# EAGLE design NEW デバッカー10 (EAGLE 9.6.2)

## Sheet 1 of 2
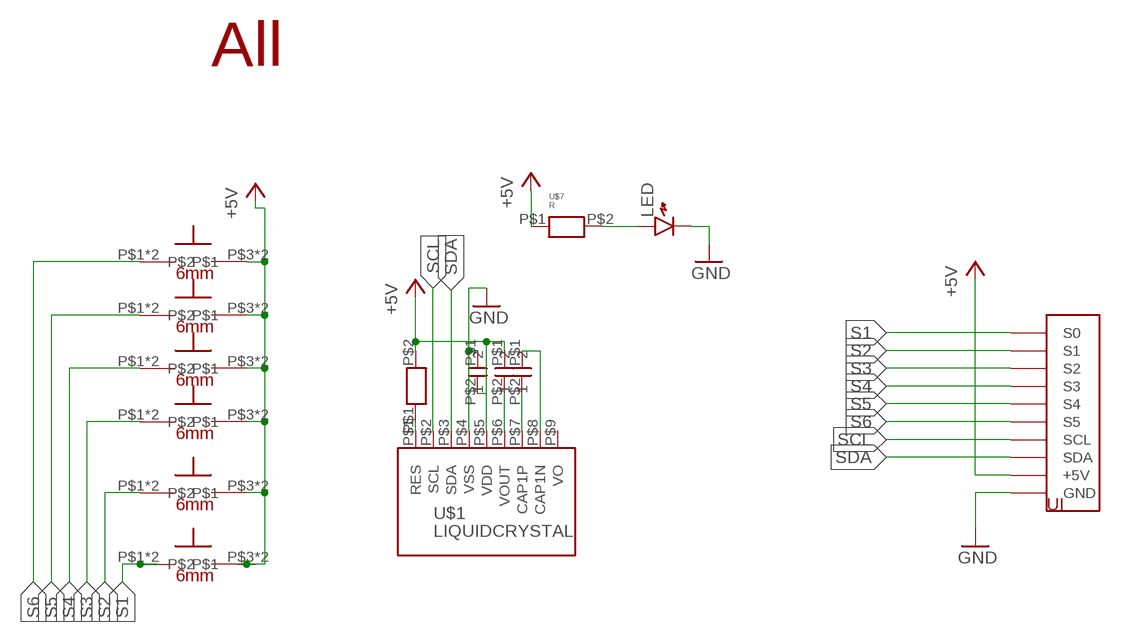
[diagram p0: schematic, sheet 1]

### Parts
LED  LED1608  [LED1608]
U$1  LIQUIDCRYSTAL  [LIQUIDCRYSTAL]
U$2  1608  [CON]
U$3  1608  [CON]
U$4  R  [1608]
U$5  1608  [CON]
U$6  TAKUTO6MM  [TAKUTO6MM]
U$7  R  [1608]
U$8  UI  [UI]
U$9  ALL  [ALL]
U$10  TAKUTO6MM  [TAKUTO6MM]
U$11  TAKUTO6MM  [TAKUTO6MM]
U$12  TAKUTO6MM  [TAKUTO6MM]
U$13  TAKUTO6MM  [TAKUTO6MM]
U$14  TAKUTO6MM  [TAKUTO6MM]

### Nets
+5V: U$1.P$5(VDD) U$2.P$1 U$4.P$2 U$5.P$2 U$6.P$3 U$6.P$4 U$7.P$1 U$8.P$1(+5V) U$10.P$3 U$10.P$4 U$11.P$3 U$11.P$4 U$12.P$3 U$12.P$4 U$13.P$3 U$13.P$4 U$14.P$3 U$14.P$4
GND: LED.K U$1.P$4(VSS) U$5.P$1 U$8.P$2(GND)
N$1: LED.A U$7.P$2
N$5: U$1.P$7(CAP1P) U$3.P$2
N$6: U$1.P$8(CAP1N) U$3.P$1
N$7: U$1.P$6(VOUT) U$2.P$2
N$13: U$1.P$1(RES) U$4.P$1
S1: U$6.P$1 U$6.P$2 U$8.P$3(S0)
S2: U$8.P$4(S1) U$10.P$1 U$10.P$2
S3: U$8.P$5(S2) U$11.P$1 U$11.P$2
S4: U$8.P$6(S3) U$12.P$1 U$12.P$2
S5: U$8.P$7(S4) U$13.P$1 U$13.P$2
S6: U$8.P$8(S5) U$14.P$1 U$14.P$2
SCL: U$1.P$2(SCL) U$8.P$9(SCL)
SDA: U$1.P$3(SDA) U$8.P$10(SDA)
Unconnected: U$1.P$9(VO)

## Sheet 2 of 2

## Library data of the parts
LED = generic:LED: Generic LEDs
U$1 = I2C液晶:LIQUIDCRYSTAL
U$2 U$3 U$5 = con1608:1608
U$4 U$7 = R 1608:R
U$6 U$10-U$14 = タクト6mm正解:TAKUTO6MM
U$8 = UI:UI
U$9 = All_outlook:ALL

## Net classes
0 default: width 0.254 mm

## Board
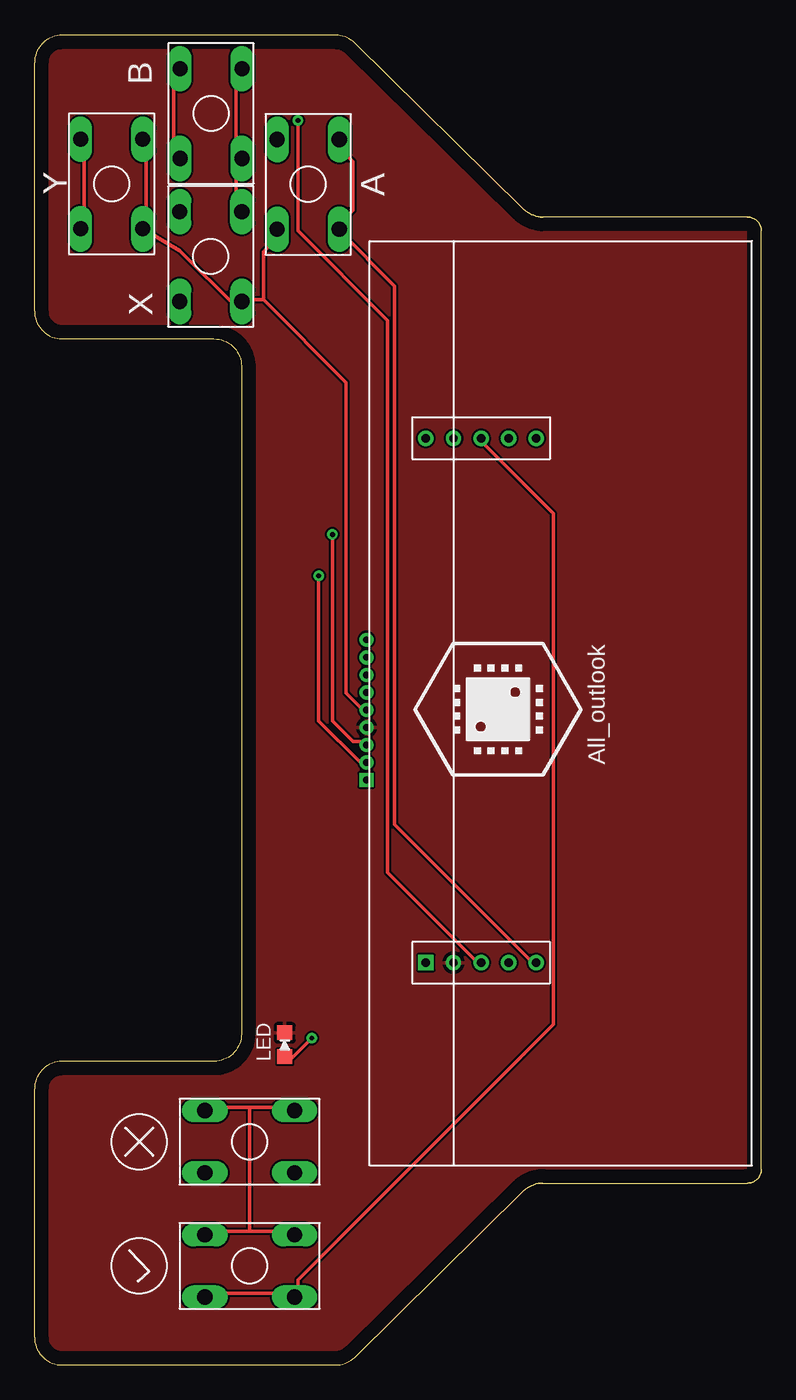
[diagram p1: board, top side]
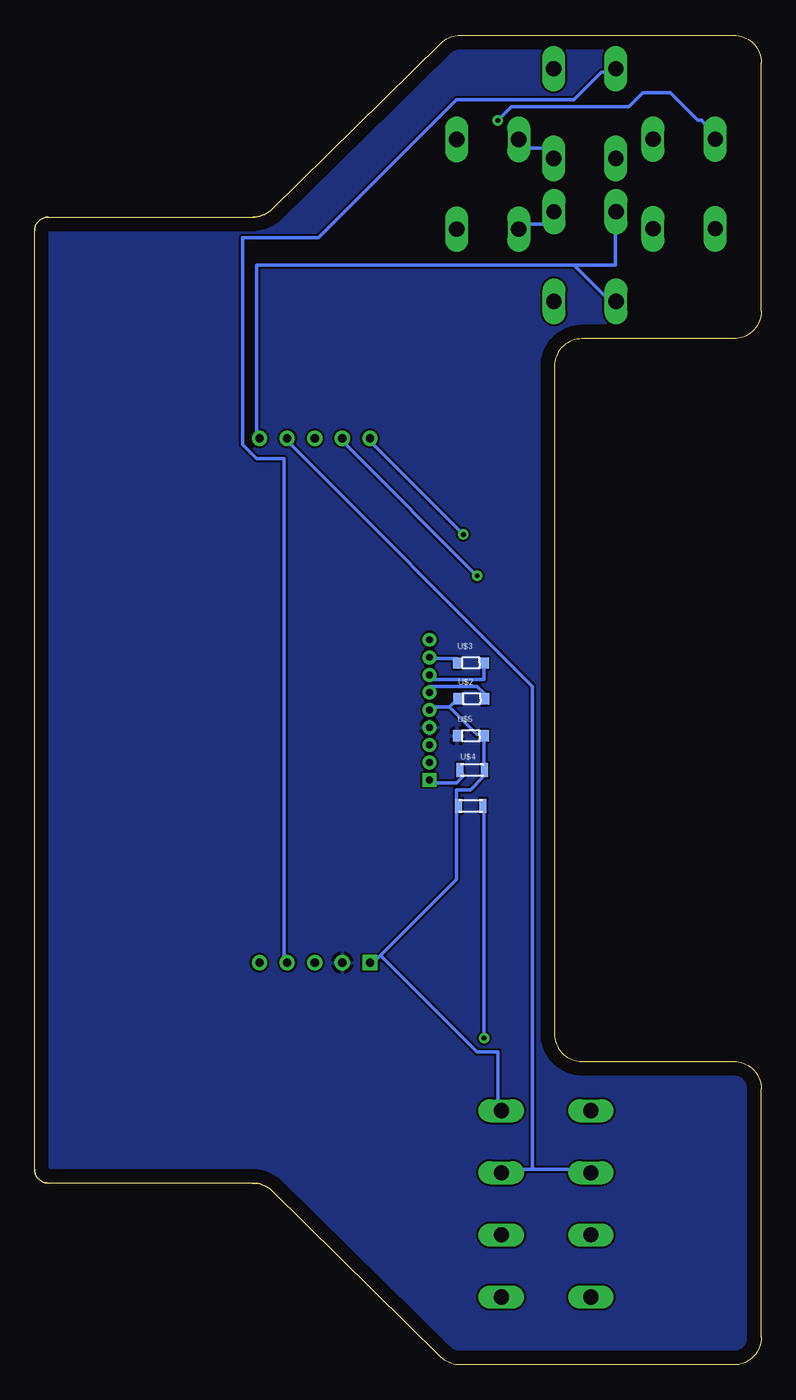
[diagram p2: board, bottom side, seen from below]

Size 52.68 x 96.36 mm. Coordinates in mm from the lower left corner, seen from the top.
Outline: 35.45,83.75 arc45 36.85,83.18
Outline: 51.68,83.18 arc-90 52.68,82.18
Outline: 52.68,14.18 arc-90 51.68,13.18
Outline: 36.85,13.18 arc45 35.45,12.6
Outline: 35.45,12.6 23.21,0.57 arc-45 21.81,0 2,0 arc-90 0,2 0,20 arc-90 2,22 13,22 arc90 15,24 15,72.36 arc90 13,74.36 2,74.36 arc-90 0,76.36 0,94.36 arc-90 2,96.36 21.81,96.36 arc-45 23.21,95.78 35.45,83.75
Outline: 35.45,12.6 arc-45 36.85,13.18
Outline: 36.85,13.18 51.68,13.18
Outline: 51.68,13.18 arc90 52.68,14.18
Outline: 52.68,14.18 52.68,82.18
Outline: 52.68,82.18 arc90 51.68,83.18
Outline: 51.68,83.18 36.85,83.18
Outline: 36.85,83.18 arc-45 35.45,83.75
Copper layers (1*16): Top 0.035mm / dielectric 1.5mm / Bottom 0.035mm
Design rules "default": minimum track width 6mil, minimum drill 0.35mm, track to track 6mil, track to pad 6mil, pad to pad 6mil, via to via 6mil, smd to smd 6mil, copper to edge 40mil, drill to drill 6mil, minimum pad ring 10mil, minimum via ring 8mil, stop-mask expansion 4mil, vias tented up to drill 0mil, thermal gap 10mil

### Footprints (pad centres in the part's own frame; a part is rotated, then mirrored left to right if it is on the bottom)
LED1608 = smd 1.05 x 1.08: A -0.875,0; K 0.875,0
LIQUIDCRYSTAL = drill 0.5 square: P$1 27.94,27.94 | drill 0.5: P$2 29.21,27.94; P$3 30.48,27.94; P$4 31.75,27.94; P$5 33.02,27.94; P$6 34.29,27.94; P$7 35.56,27.94; P$8 36.83,27.94; P$9 38.1,27.94
CON = smd 0.6 x 0.813: P$1 -1,0; P$2 1,0
1608 = smd 0.508 x 1.016: P$1 -0.889,0; P$2 0.889,0
TAKUTO6MM = drill 1.1 long: P$1 -3.25,2.25; P$2 3.25,2.25; P$3 -3.25,-2.25; P$4 3.25,-2.25
UI = drill 0.6 square: P$1 1,-1.5 | drill 0.6: P$2 3,-1.5; P$3 5,-1.5; P$4 7,-1.5; P$5 9,-1.5; P$6 9,36.5; P$7 7,36.5; P$8 5,36.5; P$9 3,36.5; P$10 1,36.5

### Placement (x,y rotation side)
LED  18.14,23.2 90 top
U$1  51.99,14.45 90 top
U$2  21,48.28 0 bottom
U$3  21.05,50.87 0 bottom
U$4  20.95,43.1 0 bottom
U$5  21.05,45.59 0 bottom
U$6  5.6,85.57 90 top
U$7  21.05,40.51 0 bottom
U$8  27.37,30.65 0 top
U$9  33.34,47.26 90 top
U$10  12.8,90.68 90 top
U$11  19.83,85.55 270 top
U$12  12.78,80.32 90 top
U$13  15.6,16.18 180 top
U$14  15.6,7.18 180 top

### Tracks (layer width: path | path; a pad name or v marks a point on that pad's centre or on a via)
+5V
  Top 0.254: U$10.P$4 14.6,93.68 14.6,87.68 U$10.P$3 14.6,87.18 14.6,83.68 U$12.P$4 | U$6.P$4 8.1,88.68 8.1,82.68 U$6.P$3 10.52,80.75 14.6,76.68 U$12.P$3 15.1,77.18 16.6,77.18 | 16.6,77.18 16.6,80.68 17.1,81.18 17.1,81.88 U$11.P$4 | 15.6,9.68 18.6,9.68 U$14.P$3 | 15.6,9.68 12.6,9.68 U$14.P$4 | 15.6,18.68 18.6,18.68 U$13.P$3 | 15.6,18.68 12.6,18.68 U$13.P$4 | 15.6,18.68 15.6,9.68 | 16.6,77.18 22.6,71.18 22.6,48.68 23.6,47.68 U$1.P$5
  Bottom 0.254: 22.17,48.41 U$2.P$1 22.1,48.18 22.6,47.68 | U$12.P$3 | U$10.P$3 15.1,87.68 15.6,88.18 16.86,88.18 U$11.P$3 | U$12.P$4 15.1,83.18 15.6,82.68 17.1,82.68 17.49,82.28 U$11.P$4 | 22.6,47.68 23.6,47.68 U$1.P$5 | 20.1,45.68 20.1,43.18 U$4.P$2 20.1,42.68 21.1,41.68 22.1,41.68 22.1,40.68 U$7.P$1 22.1,40.18 22.1,35.18 27.6,29.68 | 27.6,29.68 28.1,29.18 U$8.P$1 | 22.6,47.68 20.6,45.68 20.1,45.68 | 20.1,45.68 U$5.P$2 | 27.6,29.68 20.6,22.68 19.1,22.68 19.1,18.68 U$13.P$3
GND
  Top 0.254: 18.24,24.17 LED.K
  pour Bottom: -17.4,126.18 -18.4,-18.82 61.6,-13.82 66.6,109.18
  pour Top: -23.4,132.18 -21.4,-24.82 74.6,-17.82 81.6,119.18
N$1  (via drill 0.35)
  Top 0.254: 18.24,22.34 LED.A 18.6,22.18 v20.1,23.68
  Bottom 0.254: v20.1,23.68 20.1,40.18 U$7.P$2
N$5
  Bottom 0.254: U$3.P$2 20.1,50.68 20.1,49.68 24.1,49.68 U$1.P$7
N$6
  Bottom 0.254: U$3.P$1 22.1,51.18 23.6,51.18 U$1.P$8
N$7
  Bottom 0.254: U$2.P$2 20.1,48.68 20.6,49.18 24.1,49.18 U$1.P$6
N$13
  Bottom 0.254: U$4.P$1 21.6,42.68 22.1,42.18 23.6,42.18 U$1.P$1
S1  (via drill 0.35)
  Top 0.254: v19.1,90.18 19.1,82.18 25.6,75.68 25.6,35.68 32.1,29.18 U$8.P$3 | U$6.P$2 3.6,88.68 3.6,82.68 U$6.P$1
  Bottom 0.254: v19.1,90.18 18.1,91.18 9.6,91.18 8.6,92.18 6.6,92.18 4.6,90.18 4.3,90.18 U$6.P$2
S2
  Top 0.254: U$10.P$1 10.1,87.68 10.1,93.68 U$10.P$2
  Bottom 0.254: U$8.P$4 34.6,29.18 34.6,65.68 36.6,65.68 37.6,66.68 37.6,81.68 32.1,81.68 22.1,91.68 13.6,91.68 11.6,93.68 10.6,93.68 U$10.P$2
S3
  Top 0.254: U$8.P$5 36.1,29.18 26.1,39.18 26.1,78.18 22.1,82.18 22.1,82.38 | 22.1,82.38 22.1,82.68 23.1,83.68 23.1,87.18 22.1,88.17 U$11.P$1 | 22.1,82.38 U$11.P$2
S4
  Bottom 0.254: 13.6,79.68 36.6,79.68 36.6,67.18 U$8.P$6 | 13.6,79.68 11.1,77.18 10.6,77.18 U$12.P$1 | 13.6,79.68 10.6,79.68 10.6,83.18 U$12.P$2
S5
  Bottom 0.254: 16.6,14.18 16.6,49.18 34.1,66.68 U$8.P$7 | 16.6,14.18 18.6,14.18 U$13.P$1 | 16.6,14.18 12.6,14.18 U$13.P$2
S6
  Top 0.254: U$8.P$8 32.6,66.68 37.6,61.68 37.6,24.68 19.1,6.18 19.1,5.18 U$14.P$1 18.6,5.18 12.6,5.18 U$14.P$2
SCL  (via drill 0.35)
  Top 0.254: v20.6,57.18 20.6,46.68 23.6,43.68 U$1.P$2
  Bottom 0.254: v20.6,57.18 30.1,66.68 U$8.P$9
SDA  (via drill 0.35)
  Top 0.254: v21.6,60.18 21.6,46.68 23.1,45.18 23.6,45.18 U$1.P$3
  Bottom 0.254: v21.6,60.18 28.1,66.68 U$8.P$10

### Text on the board
tPlace: B | Y | A | X